# EAGLE design MultiPurpose (EAGLE 7.7.0)

## Sheet 1 of 2
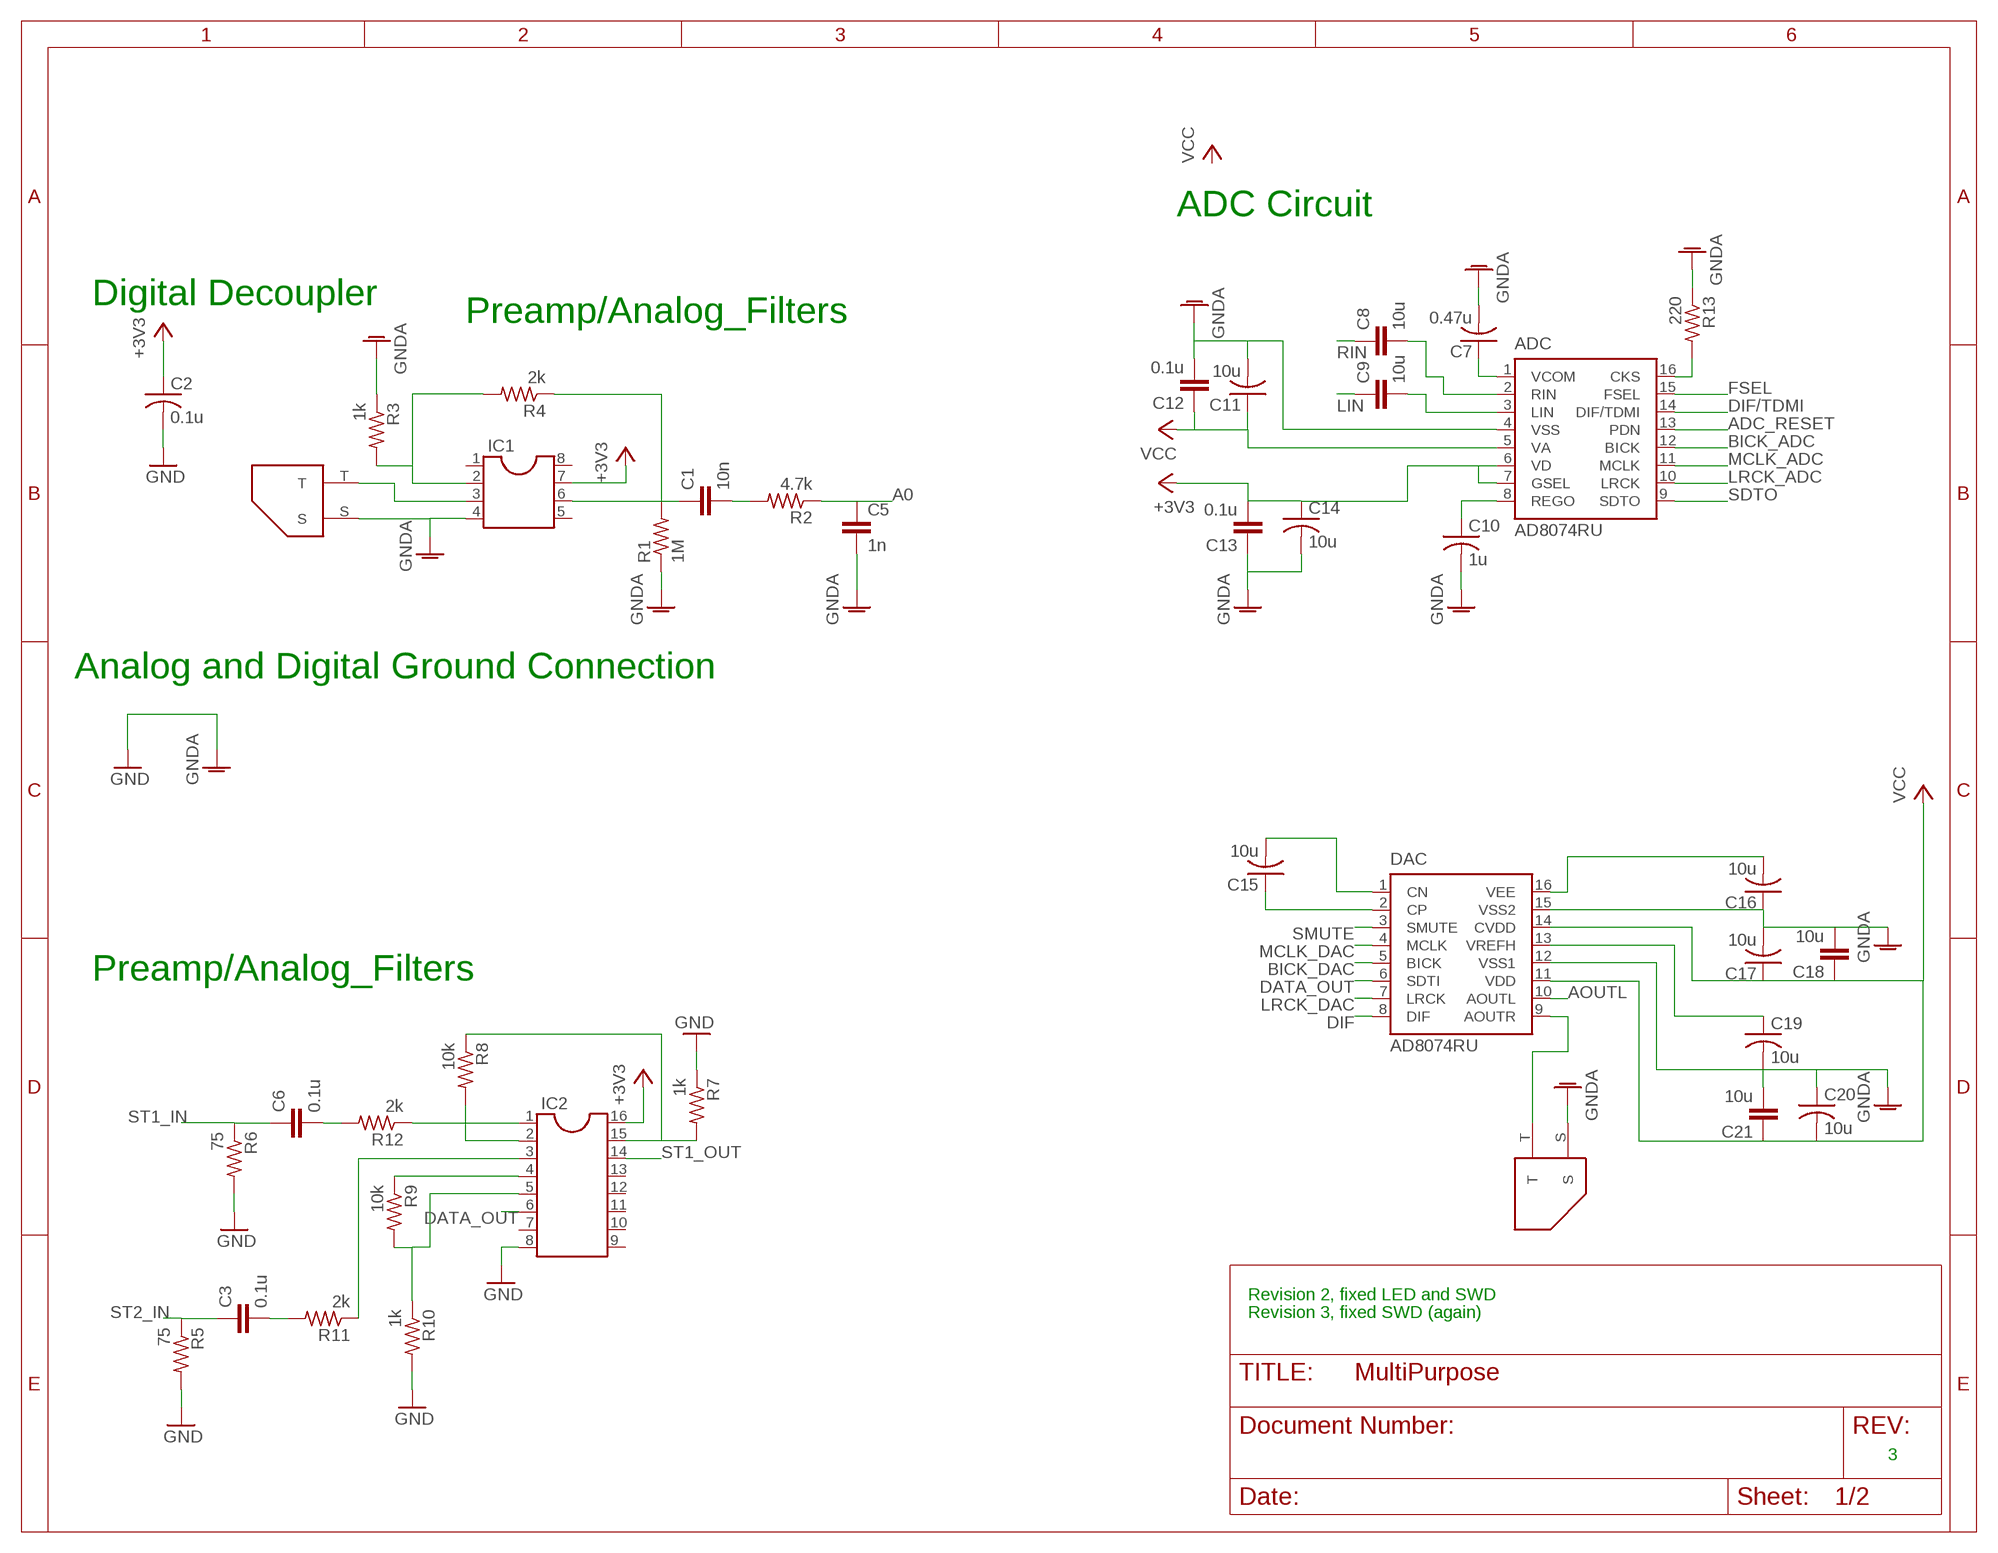
[diagram p0: schematic, sheet 1]

### Parts
ADC  AD8074RU  [TSSOP16]
C1  10n  C2.5/2  [C2.5-2]
C2  0.1u  C-US050-024X044  [C050-024X044]
C3  0.1u  C2.5/2  [C2.5-2]
C5  1n  C2.5/2  [C2.5-2]
C6  0.1u  C2.5/2  [C2.5-2]
C7  0.47u  C-US050-024X044  [C050-024X044]
C8  10u  C2.5/2  [C2.5-2]
C9  10u  C2.5/2  [C2.5-2]
C10  1u  C-US050-024X044  [C050-024X044]
C11  10u  C-US050-024X044  [C050-024X044]
C12  0.1u  C2.5/2  [C2.5-2]
C13  0.1u  C2.5/2  [C2.5-2]
C14  10u  C-US050-024X044  [C050-024X044]
C15  10u  C-US050-024X044  [C050-024X044]
C16  10u  C-US050-024X044  [C050-024X044]
C17  10u  C-US050-024X044  [C050-024X044]
C18  10u  C2.5/2  [C2.5-2]
C19  10u  C-US050-024X044  [C050-024X044]
C20  10u  C-US050-024X044  [C050-024X044]
C21  10u  C2.5/2  [C2.5-2]
DAC  AD8074RU  [TSSOP16]
IC1  DIL8S  [SOCKET-08]
IC2  DIL16S  [SOCKET-16]
R1  1M  R-US_0207/10  [0207/10]
R2  4.7k  R-US_0207/10  [0207/10]
R3  1k  R-US_0207/10  [0207/10]
R4  2k  R-US_0207/10  [0207/10]
R5  75  R-US_0207/10  [0207/10]
R6  75  R-US_0207/10  [0207/10]
R7  1k  R-US_0207/10  [0207/10]
R8  10k  R-US_0207/10  [0207/10]
R9  10k  R-US_0207/10  [0207/10]
R10  1k  R-US_0207/10  [0207/10]
R11  2k  R-US_0207/10  [0207/10]
R12  2k  R-US_0207/10  [0207/10]
R13  220  R-US_0207/10  [0207/10]
U$1  TS_JACK  [MONO_1]
U$2  TS_JACK  [MONO_1]

### Nets
+3V3: ADC.6(VD) ADC.7(GSEL) C13.2 C14.1 IC1.7 IC2.16 ; also sheet 2
+5V5: C2.1 ; supply symbol labelled +3V3
A0: C5.1 R2.1
ADC_RESET: ADC.13(PDN)
AOUTL: DAC.10(AOUTL)
AOUTR: DAC.9(AOUTR) U$2.T
BICK_ADC: ADC.12(BICK)
BICK_DAC: DAC.5(BICK)
DATA_OUT: DAC.6(SDTI) IC2.5 IC2.6 R9.2 R10.1
DIF: DAC.8(DIF)
DIF/TDMI: ADC.14(DIF/TDMI)
FSEL: ADC.15(FSEL)
GND: C2.2 IC2.8 R5.2 R6.2 R7.1 R10.2 ; supply symbol labelled GNDA ; also sheet 2
GNDA: ADC.4(VSS) C5.2 C7.2 C10.2 C11.2 C12.2 C13.1 C14.2 C16.1 C17.2 C18.2 C19.2 C20.1 C21.2 DAC.12(VSS1) DAC.15(VSS2) IC1.4 R1.1 R3.1 R13.1 U$1.S U$2.S
LIN: C9.1
LRCK_ADC: ADC.10(LRCK)
LRCK_DAC: DAC.7(LRCK)
MCLK_ADC: ADC.11(MCLK)
MCLK_DAC: DAC.4(MCLK)
N$1: ADC.1(VCOM) C7.1
N$2: IC1.3 U$1.T
N$3: IC1.2 R3.2 R4.2
N$4: C6.2 R12.2
N$5: C1.1 IC1.6 R1.2 R4.1
N$6: C1.2 R2.2
N$7: IC2.1 R12.1
N$8: IC2.2 R8.2
N$9: IC2.15 R7.2 R8.1
N$10: C3.2 R11.2
N$11: IC2.3 R11.1
N$12: IC2.4 R9.1
N$14: ADC.3(LIN) C9.2
N$15: ADC.2(RIN) C8.2
N$16: C16.2 DAC.16(VEE)
N$17: ADC.8(REGO) C10.1
N$18: ADC.16(CKS) R13.2
N$19: C15.2 DAC.1(CN)
N$20: C15.1 DAC.2(CP)
N$21: C19.1 DAC.13(VREFH)
RIN: C8.1
SDTO: ADC.9(SDTO)
SMUTE: DAC.3(SMUTE)
ST1_IN: C6.1 R6.1
ST1_OUT: IC2.14
ST2_IN: C3.1 R5.1
VCC: ADC.5(VA) C11.1 C12.1 C17.1 C18.1 C20.2 C21.1 DAC.11(VDD) DAC.14(CVDD)
Unconnected: IC1.1 IC1.5 IC1.8 IC2.7 IC2.9 IC2.10 IC2.11 IC2.12 IC2.13

### Notes on the sheet
- ADC Circuit
- Digital Decoupler
- Preamp/Analog_Filters
- Analog and Digital Ground Connection
- Preamp/Analog_Filters
- Revision 2, fixed LED and SWD
- Revision 3, fixed SWD (again)
- 3

## Sheet 2 of 2
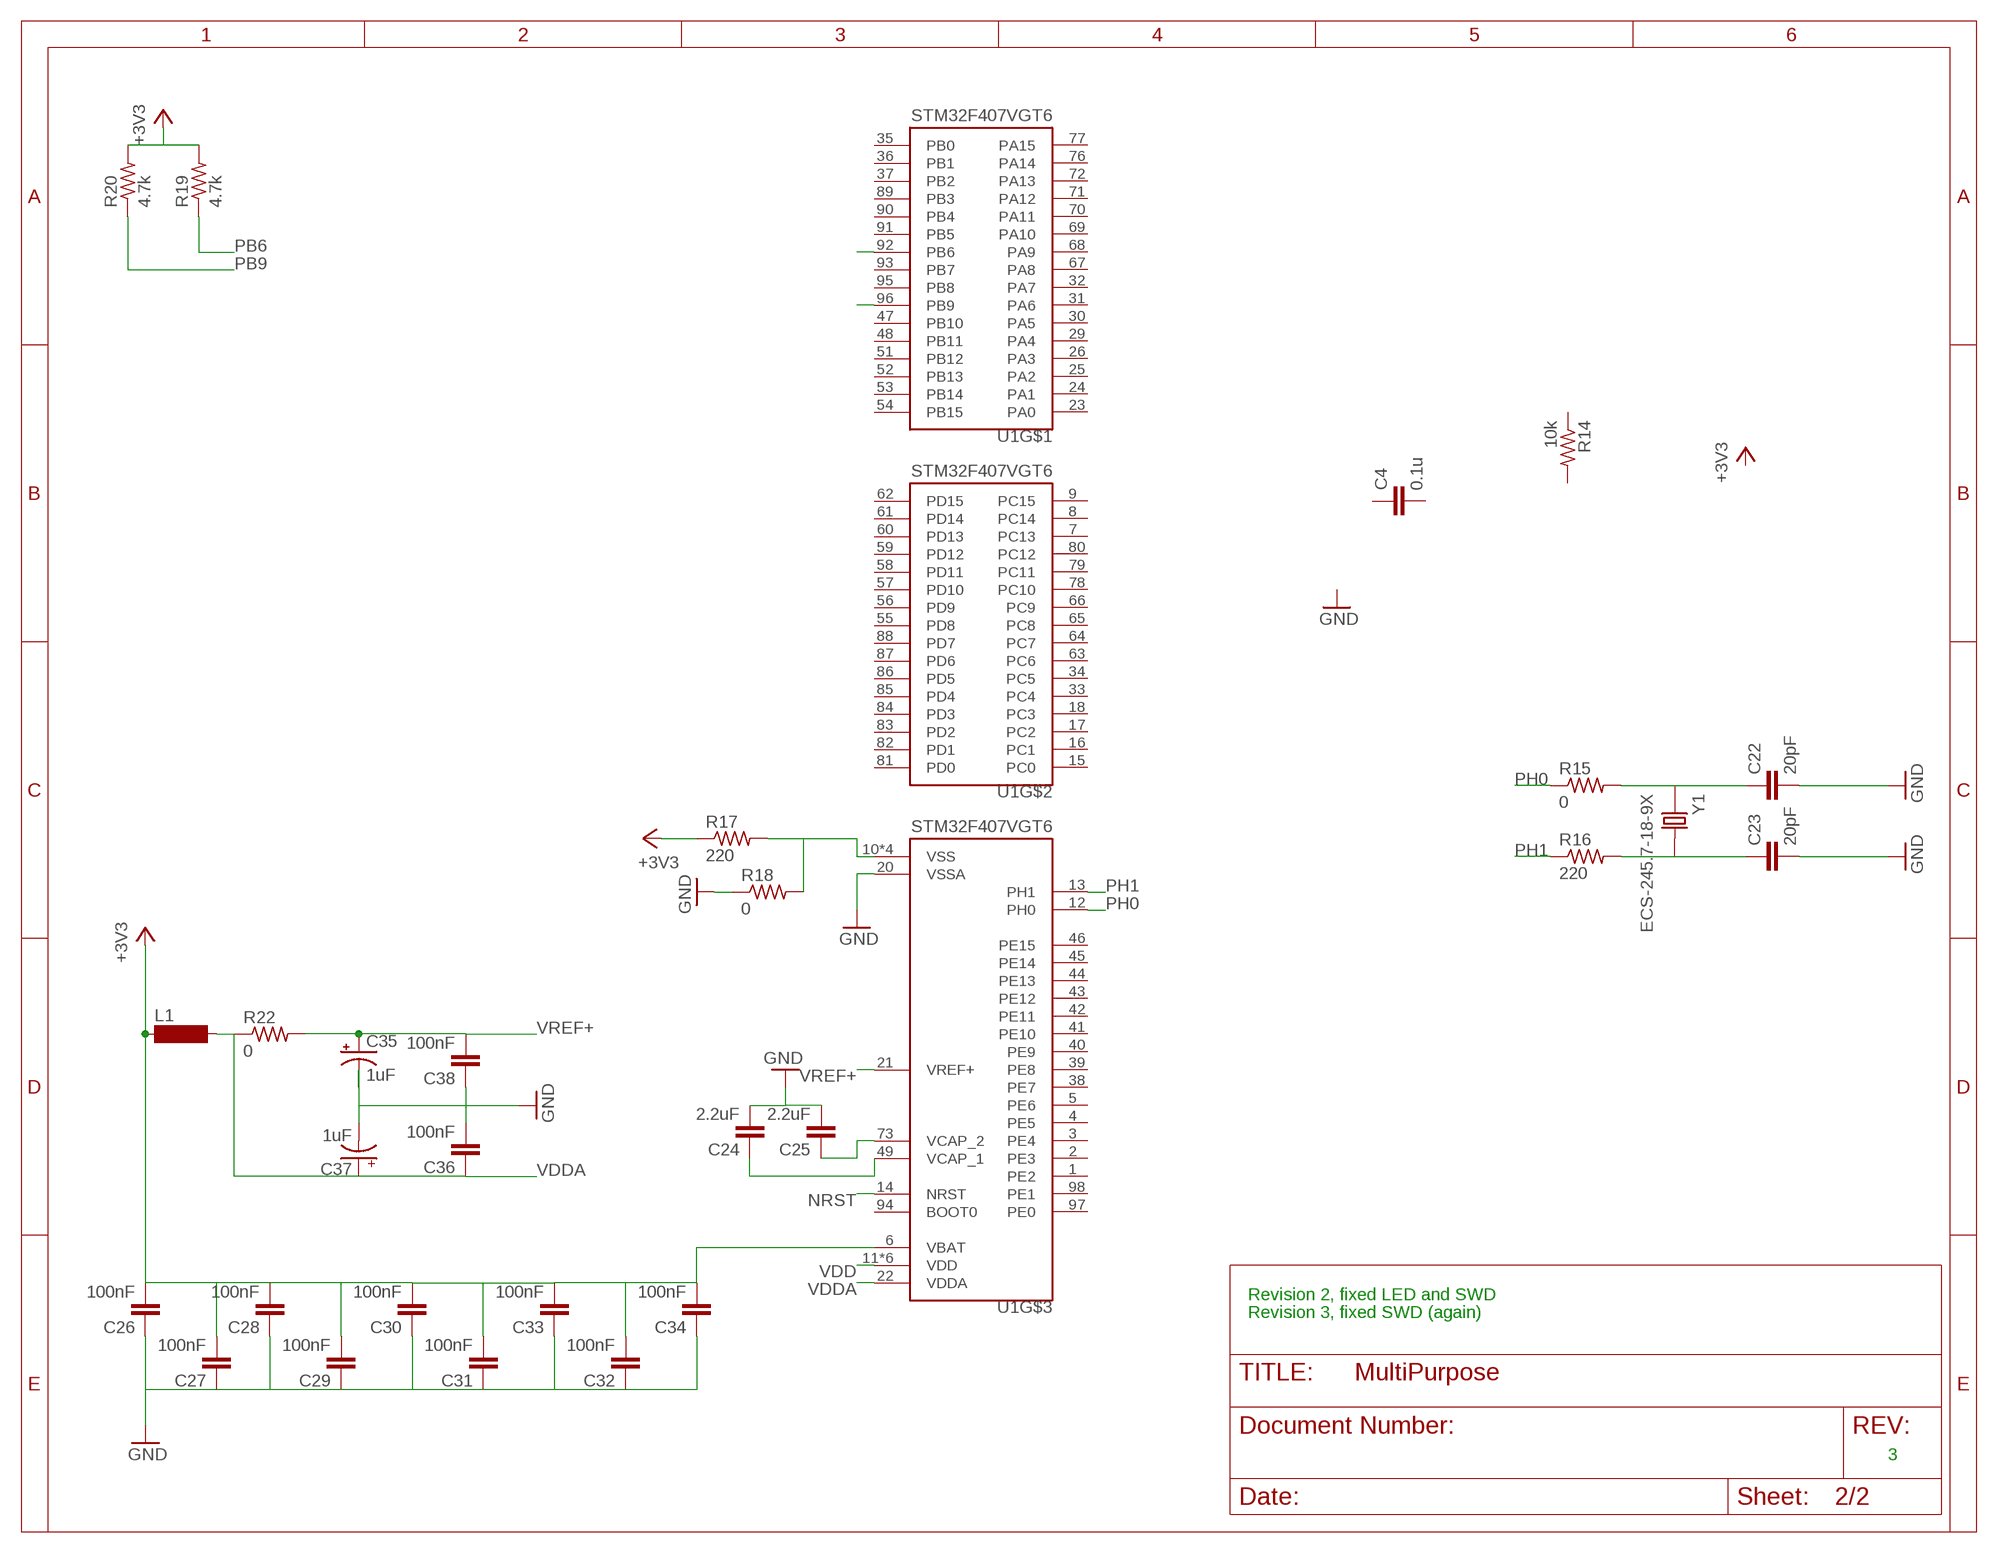
[diagram p1: schematic, sheet 2]

### Parts
C4  0.1u  C2.5/2  [C2.5-2]
C22  20pF  C2.5/2  [C2.5-2]
C23  20pF  C2.5/2  [C2.5-2]
C24  2.2uF  C2.5/2  [C2.5-2]
C25  2.2uF  C2.5/2  [C2.5-2]
C26  100nF  C2.5/2  [C2.5-2]
C27  100nF  C2.5/2  [C2.5-2]
C28  100nF  C2.5/2  [C2.5-2]
C29  100nF  C2.5/2  [C2.5-2]
C30  100nF  C2.5/2  [C2.5-2]
C31  100nF  C2.5/2  [C2.5-2]
C32  100nF  C2.5/2  [C2.5-2]
C33  100nF  C2.5/2  [C2.5-2]
C34  100nF  C2.5/2  [C2.5-2]
C35  1uF  CPOL-US139CLL-3R  [139CLL-3R]
C36  100nF  C2.5/2  [C2.5-2]
C37  1uF  CPOL-US139CLL-3R  [139CLL-3R]
C38  100nF  C2.5/2  [C2.5-2]
L1  BS75  [BS75]
R14  10k  R-US_0207/10  [0207/10]
R15  0  R-US_0207/10  [0207/10]
R16  220  R-US_0207/10  [0207/10]
R17  220  R-US_0207/10  [0207/10]
R18  0  R-US_0207/10  [0207/10]
R19  4.7k  R-US_0207/10  [0207/10]
R20  4.7k  R-US_0207/10  [0207/10]
R22  0  R-US_0207/10  [0207/10]
U1  STM32F407VGT6  [QFP50P1600X1600X160-100N]
Y1  ECS-245.7-18-9X  [XTAL_ECS-245.7-18-9X]

### Nets
+3V3: C26.2 C27.2 C28.2 C29.2 C30.2 C31.2 C32.2 C33.2 C34.2 L1.1 R17.1 R19.2 R20.2 U1.6(VBAT) ; also sheet 1
GND: C22.2 C23.2 C24.2 C25.2 C26.1 C27.1 C28.1 C29.1 C30.1 C31.1 C32.1 C33.1 C34.1 C35.- C37.- R18.1 U1.20(VSSA) ; also sheet 1
N$13: C23.1 R16.2 Y1.2
N$22: C22.1 R15.2 Y1.1
N$23: R17.2 R18.2 U1.10(VSS) U1.27(VSS) U1.74(VSS) U1.99(VSS)
N$24: C24.1 U1.49(VCAP_1)
N$25: C25.1 U1.73(VCAP_2)
N$28: C36.2 C38.1
NRST: U1.14(NRST)
PB6: R19.1 U1.92(PB6)
PB9: R20.1 U1.96(PB9)
PH0: R15.1 U1.12(PH0)
PH1: R16.1 U1.13(PH1)
VDD: U1.11(VDD) U1.19(VDD) U1.28(VDD) U1.50(VDD) U1.75(VDD) U1.100(VDD)
VDDA: C36.1 C37.+ L1.2 R22.1 U1.22(VDDA)
VREF+: C35.+ C38.2 R22.2 U1.21(VREF+)
Unconnected: C4.1 C4.2 R14.1 R14.2 U1.1(PE2) U1.2(PE3) U1.3(PE4) U1.4(PE5) U1.5(PE6) U1.7(PC13) U1.8(PC14) U1.9(PC15) U1.15(PC0) U1.16(PC1) U1.17(PC2) U1.18(PC3) U1.23(PA0) U1.24(PA1) U1.25(PA2) U1.26(PA3) U1.29(PA4) U1.30(PA5) U1.31(PA6) U1.32(PA7) U1.33(PC4) U1.34(PC5) U1.35(PB0) U1.36(PB1) U1.37(PB2) U1.38(PE7) U1.39(PE8) U1.40(PE9) U1.41(PE10) U1.42(PE11) U1.43(PE12) U1.44(PE13) U1.45(PE14) U1.46(PE15) U1.47(PB10) U1.48(PB11) U1.51(PB12) U1.52(PB13) U1.53(PB14) U1.54(PB15) U1.55(PD8) U1.56(PD9) U1.57(PD10) U1.58(PD11) U1.59(PD12) U1.60(PD13) U1.61(PD14) U1.62(PD15) U1.63(PC6) U1.64(PC7) U1.65(PC8) U1.66(PC9) U1.67(PA8) U1.68(PA9) U1.69(PA10) U1.70(PA11) U1.71(PA12) U1.72(PA13) U1.76(PA14) U1.77(PA15) U1.78(PC10) U1.79(PC11) U1.80(PC12) U1.81(PD0) U1.82(PD1) U1.83(PD2) U1.84(PD3) U1.85(PD4) U1.86(PD5) U1.87(PD6) U1.88(PD7) U1.89(PB3) U1.90(PB4) U1.91(PB5) U1.93(PB7) U1.94(BOOT0) U1.95(PB8) U1.97(PE0) U1.98(PE1)

### Notes on the sheet
- Revision 2, fixed LED and SWD
- Revision 3, fixed SWD (again)
- 3

## Library data of the parts
ADC = analog-devices:AD807*: 500 MHz, G = +1 and +2 Triple Video Buffers with Disable Source: http://www.analog.com/static/imported-files/data_sheets/AD8074_8075.pdf; MPN: AD8074ARUZ; OC_FARNELL: 9426027; OC_NEWARK: 19M0929
C1 C3-C6 C8 C9 C12 C13 C18 C21-C34 C36 C38 = capacitor-wima:C: CAPACITOR naming: grid - package width
C2 C7 C10 C11 C14-C17 C19 C20 = rcl:C-US: CAPACITOR, American symbol
C35 C37 = rcl:CPOL-US: POLARIZED CAPACITOR, American symbol
DAC = analog-devices-3:AD807*: 500 MHz, G = +1 and +2 Triple Video Buffers with Disable Source: http://www.analog.com/static/imported-files/data_sheets/AD8074_8075.pdf
IC1 = ic-package:DIL8: Dual In Line / Socket
IC2 = ic-package:DIL16: Dual In Line / Socket
L1 = inductor-neosid:BS: INDUCTOR nominal inductance, magnetically screened; OC_FARNELL: unknown; OC_NEWARK: unknown
R1-R20 R22 = rcl:R-US_: RESISTOR, American symbol
U1 = STM32F407VGT6:STM32F407VGT6: STM32 Series 32-bit 1 MB Flash 192 kB RAM ARM Based Microcontroller - LQFP-100; DESCRIPTION: STM32 Series 32-bit 1 MB Flash 192 kB RAM ARM Based Microcontroller - LQFP-100; DIGI-KEY_PART_NUMBER: 497-11605-ND; DIGI-KEY_PURCHASE_URL: https://www.digikey.com/product-detail/en/stmicroelectronics/STM32F407VGT6/497-11605-ND/2747117?utm_source=snapeda&utm_medium=aggregator&utm_campaign=symbol; MF: STMicroelectronics; MP: STM32F407VGT6; PACKAGE: LQFP-100 STMicroelectronics
U$1 U$2 = MultiPurpose:TS_JACK: TS MONO Guitar Jack
Y1 = ECS-245.7-18-9X:ECS-245.7-18-9X: Crystal Cylindrical Can, Radial; DESCRIPTION: Crystal 24.576MHz 18pF 2-Pin Radial; DIGI-KEY_PART_NUMBER: XC1387-ND; DIGI-KEY_PURCHASE_URL: https://www.digikey.com/product-detail/en/ecs-inc/ECS-245.7-18-9X/XC1387-ND/827649?utm_source=snapeda&utm_medium=aggregator&utm_campaign=symbol; MF: ECS Inc.; MP: ECS-245.7-18-9X; PACKAGE: Cylindrical Can Radial ECS International

## Board
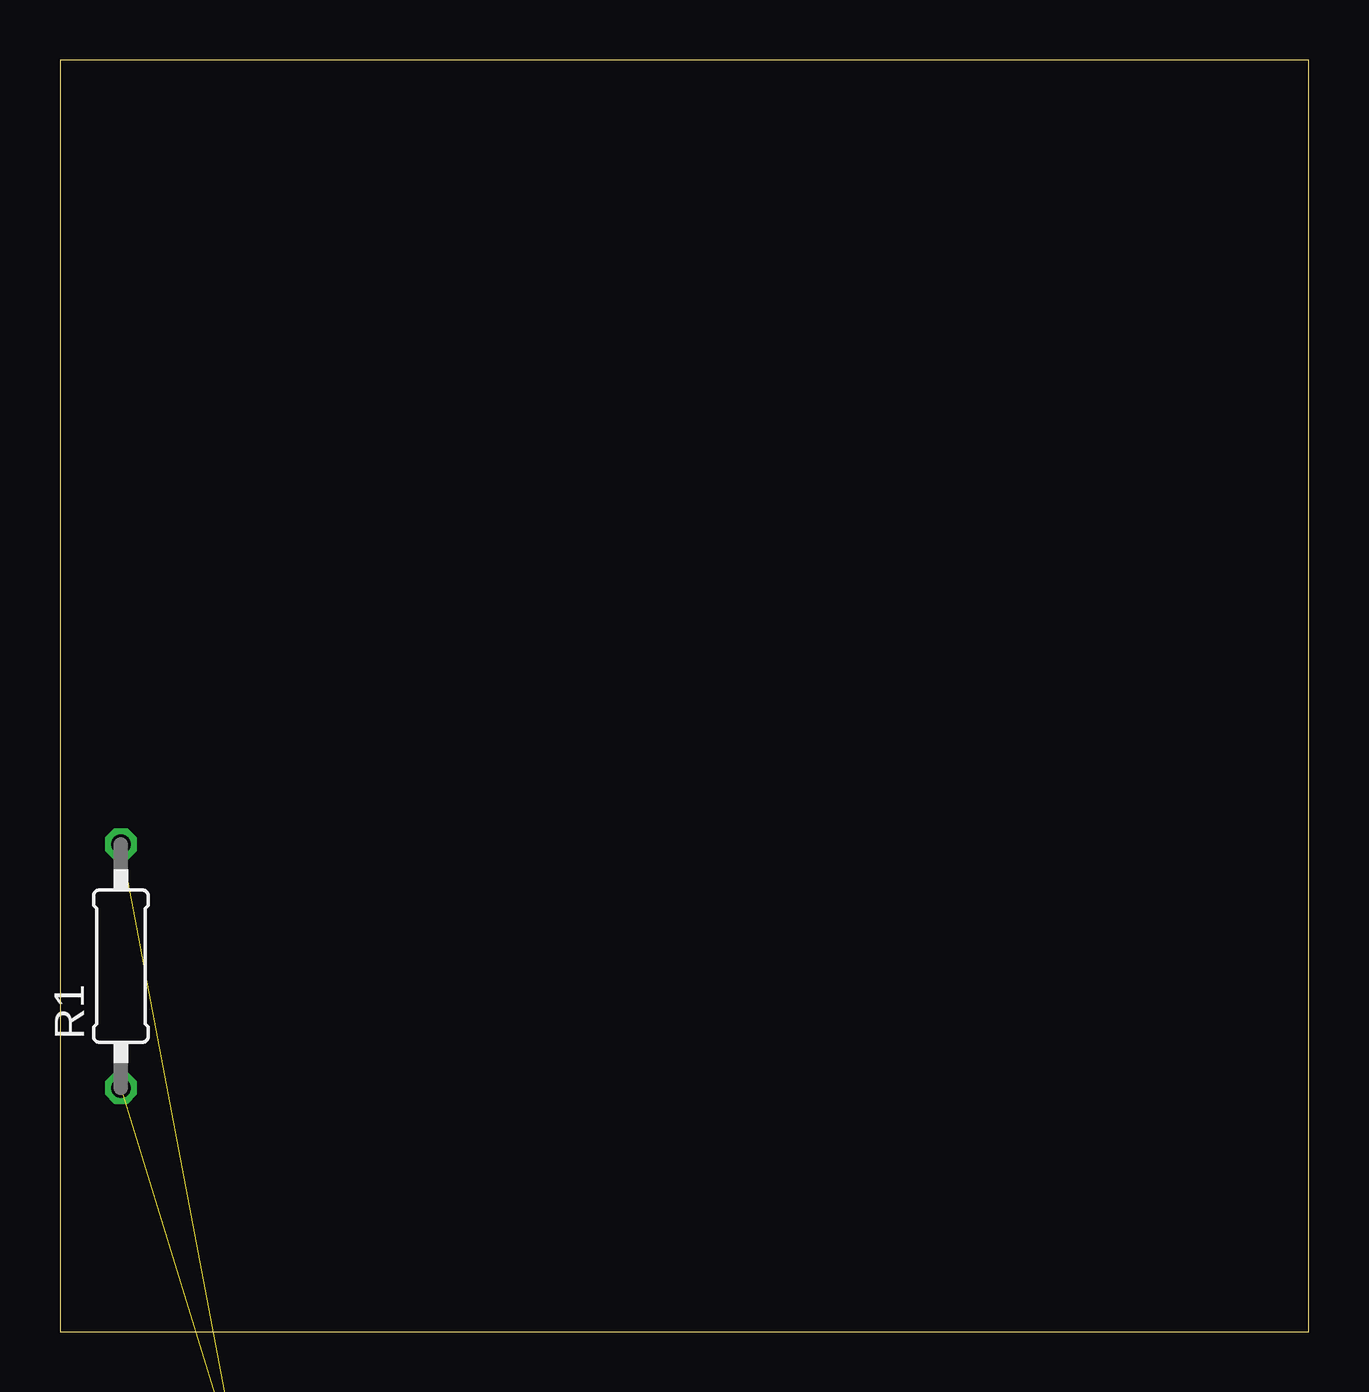
[diagram p2: board, top side]
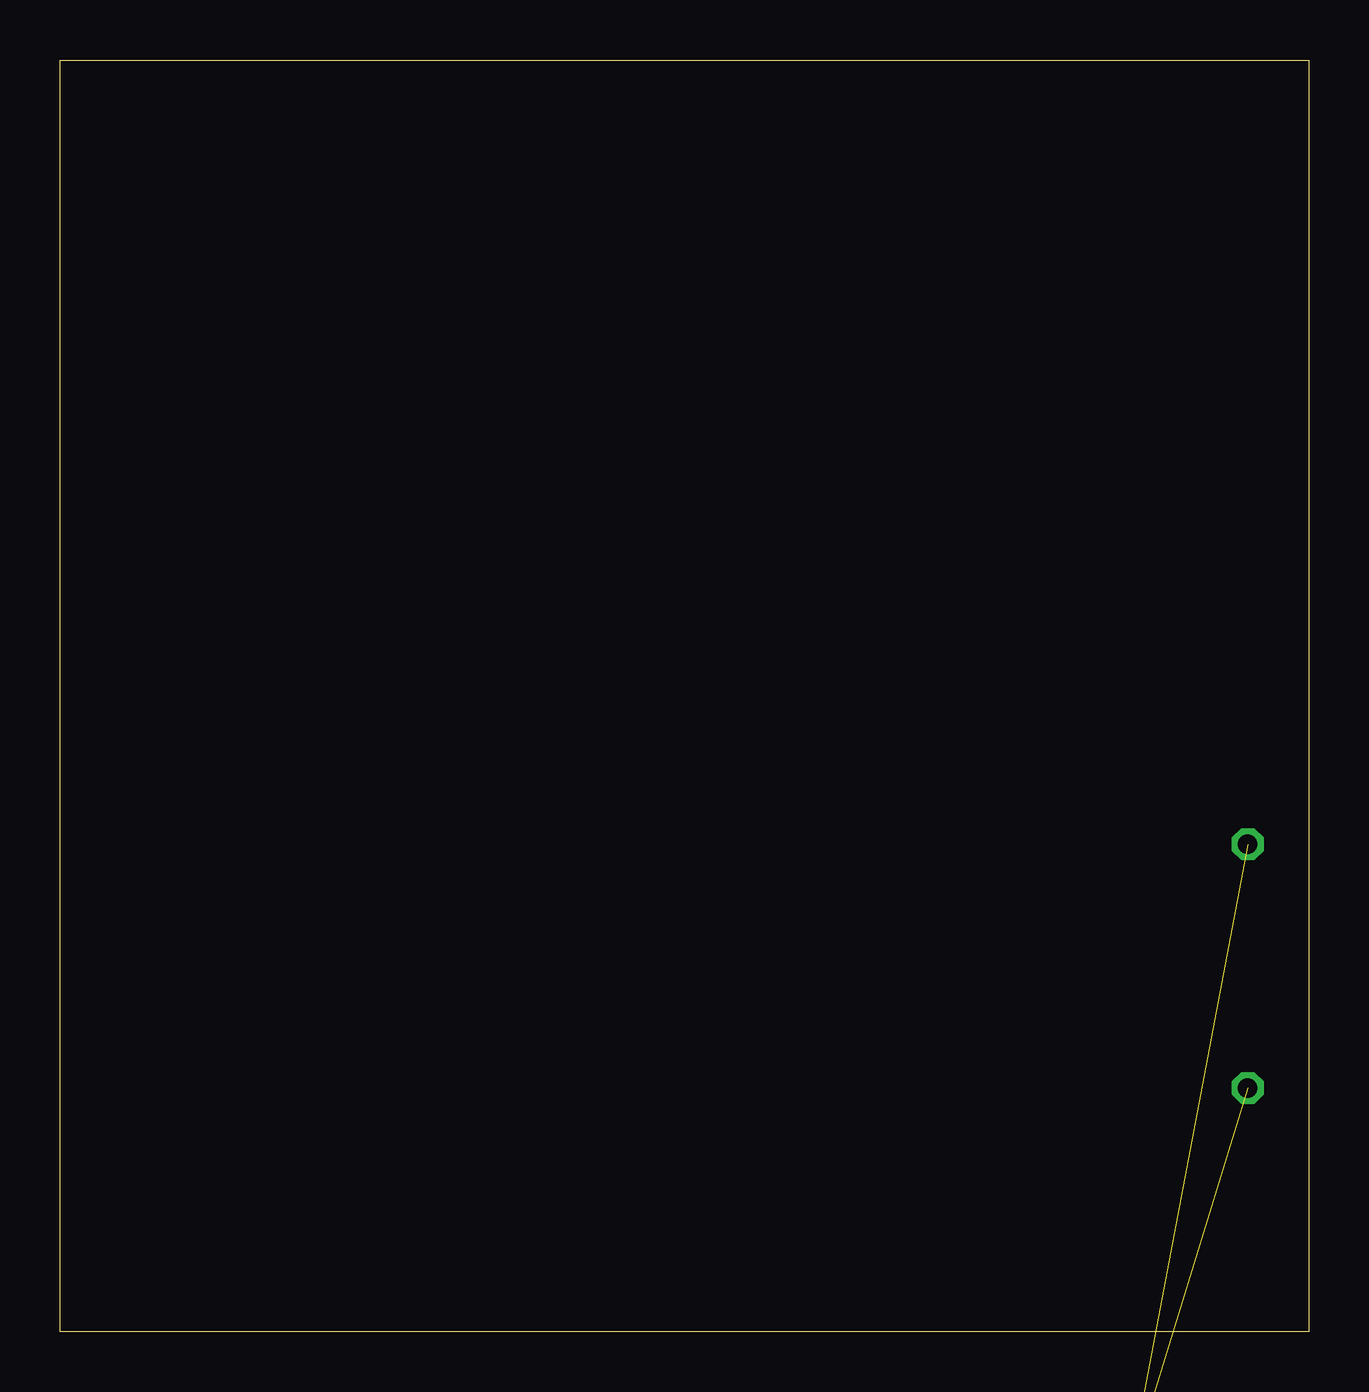
[diagram p3: board, bottom side, seen from below]

Size 52.05 x 53.01 mm. Coordinates in mm from the lower left corner, seen from the top.
Outline: 0,0 52.05,0 52.05,53.01 0,53.01 0,0
Copper layers (1*16): Top 0.035mm / dielectric 1.5mm / Bottom 0.035mm
Design rules "MWSEagleDesignRules3": minimum track width 13mil, minimum drill 22mil, track to track 8.5mil, track to pad 8.5mil, pad to pad 8.5mil, via to via 8.5mil, smd to smd 8mil, copper to edge 40mil, drill to drill 8mil, minimum pad ring 10mil, minimum via ring 8mil, stop-mask expansion 4mil, vias tented up to drill 0mil, thermal gap 10mil

### Footprints (pad centres in the part's own frame; a part is rotated, then mirrored left to right if it is on the bottom)
TSSOP16 = smd 0.9 x 0.35: 1 -2.875,2.275; 2 -2.875,1.625; 3 -2.875,0.975; 4 -2.875,0.325; 5 -2.875,-0.325; 6 -2.875,-0.975; 7 -2.875,-1.625; 8 -2.875,-2.275; 9 2.875,-2.275; 10 2.875,-1.625; 11 2.875,-0.975; 12 2.875,-0.325; 13 2.875,0.325; 14 2.875,0.975; 15 2.875,1.625; 16 2.875,2.275
C2.5-2 = drill 0.813 pad 1.6 octagon: 1 -1.27,0; 2 1.27,0
C050-024X044 = drill 0.813 octagon: 1 -2.54,0; 2 2.54,0
139CLL-3R = smd 3.5 x 2.8: + 6.2,0; - -6.2,0
SOCKET-08 = drill 0.813 long: 1 -3.81,-3.81; 2 -1.27,-3.81; 3 1.27,-3.81; 4 3.81,-3.81; 5 3.81,3.81; 6 1.27,3.81; 7 -1.27,3.81; 8 -3.81,3.81
SOCKET-16 = drill 0.813 long: 1 -8.89,-3.81; 2 -6.35,-3.81; 3 -3.81,-3.81; 4 -1.27,-3.81; 5 1.27,-3.81; 6 3.81,-3.81; 7 6.35,-3.81; 8 8.89,-3.81; 9 8.89,3.81; 10 6.35,3.81; 11 3.81,3.81; 12 1.27,3.81; 13 -1.27,3.81; 14 -3.81,3.81; 15 -6.35,3.81; 16 -8.89,3.81
BS75 = drill 0.6 long: 1 -2.5,0; 2 2.5,0
0207/10 = drill 0.813 octagon: 1 -5.08,0; 2 5.08,0
QFP50P1600X1600X160-100N = smd 1.56 x 0.28: 1 -7.68,6; 2 -7.68,5.5; 3 -7.68,5; 4 -7.68,4.5; 5 -7.68,4; 6 -7.68,3.5; 7 -7.68,3; 8 -7.68,2.5; 9 -7.68,2; 10 -7.68,1.5; 11 -7.68,1; 12 -7.68,0.5; 13 -7.68,0; 14 -7.68,-0.5; 15 -7.68,-1; 16 -7.68,-1.5; 17 -7.68,-2; 18 -7.68,-2.5; 19 -7.68,-3; 20 -7.68,-3.5; 21 -7.68,-4; 22 -7.68,-4.5; 23 -7.68,-5; 24 -7.68,-5.5; 25 -7.68,-6; 51 7.68,-6; 52 7.68,-5.5; 53 7.68,-5; 54 7.68,-4.5; 55 7.68,-4; 56 7.68,-3.5; 57 7.68,-3; 58 7.68,-2.5; 59 7.68,-2; 60 7.68,-1.5; 61 7.68,-1; 62 7.68,-0.5; 63 7.68,0; 64 7.68,0.5; 65 7.68,1; 66 7.68,1.5; 67 7.68,2; 68 7.68,2.5; 69 7.68,3; 70 7.68,3.5; 71 7.68,4; 72 7.68,4.5; 73 7.68,5; 74 7.68,5.5; 75 7.68,6 | smd 0.28 x 1.56: 26 -6,-7.68; 27 -5.5,-7.68; 28 -5,-7.68; 29 -4.5,-7.68; 30 -4,-7.68; 31 -3.5,-7.68; 32 -3,-7.68; 33 -2.5,-7.68; 34 -2,-7.68; 35 -1.5,-7.68; 36 -1,-7.68; 37 -0.5,-7.68; 38 0,-7.68; 39 0.5,-7.68; 40 1,-7.68; 41 1.5,-7.68; 42 2,-7.68; 43 2.5,-7.68; 44 3,-7.68; 45 3.5,-7.68; 46 4,-7.68; 47 4.5,-7.68; 48 5,-7.68; 49 5.5,-7.68; 50 6,-7.68; 76 6,7.68; 77 5.5,7.68; 78 5,7.68; 79 4.5,7.68; 80 4,7.68; 81 3.5,7.68; 82 3,7.68; 83 2.5,7.68; 84 2,7.68; 85 1.5,7.68; 86 1,7.68; 87 0.5,7.68; 88 0,7.68; 89 -0.5,7.68; 90 -1,7.68; 91 -1.5,7.68; 92 -2,7.68; 93 -2.5,7.68; 94 -3,7.68; 95 -3.5,7.68; 96 -4,7.68; 97 -4.5,7.68; 98 -5,7.68; 99 -5.5,7.68; 100 -6,7.68
MONO_1 = drill 0.8 square: S 1.27,0; T -1.27,0
XTAL_ECS-245.7-18-9X = drill 0.52 pad 0.92: 1 -0.55,0; 2 0.55,0

### Placement (x,y rotation side)
ADC  -8.64,-145.29 0 top  (outside the outline)
C1  -3.56,-179.83 0 top  (outside the outline)
C2  5.08,-130.56 0 top  (outside the outline)
C3  -3.56,-309.88 0 top  (outside the outline)
C4  0,-376.43 0 top  (outside the outline)
C5  5.59,-30.48 0 top  (outside the outline)
C6  -3.56,-227.58 0 top  (outside the outline)
C7  -31.5,-438.91 0 top  (outside the outline)
C8  -30.99,-453.64 0 top  (outside the outline)
C9  -30.99,-469.9 0 top  (outside the outline)
C10  -31.5,-484.63 0 top  (outside the outline)
C11  -31.5,-497.84 0 top  (outside the outline)
C12  -30.99,-512.57 0 top  (outside the outline)
C13  -30.99,-528.83 0 top  (outside the outline)
C14  -31.5,-543.56 0 top  (outside the outline)
C15  -31.5,-569.98 0 top  (outside the outline)
C16  -31.5,-583.18 0 top  (outside the outline)
C17  -31.5,-596.39 0 top  (outside the outline)
C18  -30.99,-611.12 0 top  (outside the outline)
C19  -31.5,-625.86 0 top  (outside the outline)
C20  -31.5,-639.06 0 top  (outside the outline)
C21  -30.99,-653.8 0 top  (outside the outline)
C22  -30.99,-709.68 0 top  (outside the outline)
C23  -30.99,-725.93 0 top  (outside the outline)
C24  -30.99,-768.6 0 top  (outside the outline)
C25  -30.99,-784.86 0 top  (outside the outline)
C26  -30.99,-827.53 0 top  (outside the outline)
C27  -30.99,-843.79 0 top  (outside the outline)
C28  -30.99,-860.04 0 top  (outside the outline)
C29  -30.99,-876.3 0 top  (outside the outline)
C30  -30.99,-892.56 0 top  (outside the outline)
C31  -30.99,-908.81 0 top  (outside the outline)
C32  -30.99,-925.07 0 top  (outside the outline)
C33  -30.99,-941.32 0 top  (outside the outline)
C34  -30.99,-957.58 0 top  (outside the outline)
C35  -28.45,-1073.4 0 top  (outside the outline)
C36  -30.99,-1003.3 0 top  (outside the outline)
C37  -28.45,-1083.06 0 top  (outside the outline)
C38  -30.99,-1035.81 0 top  (outside the outline)
DAC  -17.78,-352.55 0 top  (outside the outline)
IC1  6.6,-11.68 0 top  (outside the outline)
IC2  2.54,-161.04 0 top  (outside the outline)
L1  -32.51,-1062.74 0 top  (outside the outline)
R1  2.54,15.24 90 top
R2  7.62,-90.93 0 top  (outside the outline)
R3  7.62,-104.14 0 top  (outside the outline)
R4  7.62,-143.76 0 top  (outside the outline)
R5  -1.02,-295.15 0 top  (outside the outline)
R6  -1.02,-212.85 0 top  (outside the outline)
R7  -1.02,-281.94 0 top  (outside the outline)
R8  -1.02,-268.73 0 top  (outside the outline)
R9  -1.02,-337.82 0 top  (outside the outline)
R10  -1.02,-351.03 0 top  (outside the outline)
R11  -1.02,-324.61 0 top  (outside the outline)
R12  -1.02,-242.32 0 top  (outside the outline)
R13  -28.96,-556.77 0 top  (outside the outline)
R14  -28.96,-425.7 0 top  (outside the outline)
R15  -28.96,-681.74 0 top  (outside the outline)
R16  -28.96,-694.94 0 top  (outside the outline)
R17  -28.96,-740.66 0 top  (outside the outline)
R18  -28.96,-753.87 0 top  (outside the outline)
R19  -28.96,-799.59 0 top  (outside the outline)
R20  -28.96,-812.8 0 top  (outside the outline)
R22  -28.96,-1050.54 0 top  (outside the outline)
U1  -31.5,-357.12 0 top  (outside the outline)
U$1  4.06,-117.35 0 top  (outside the outline)
U$2  -32.51,-668.53 0 top  (outside the outline)
Y1  -16.26,-363.22 0 top  (outside the outline)

### Tracks (layer width: path | path; a pad name or v marks a point on that pad's centre or on a via)
+3V3  (19 unrouted)
A0  (1 unrouted)
AOUTR  (1 unrouted)
DATA_OUT  (4 unrouted)
GND  (22 unrouted)
  cutout Bottom (isolate 1.27): 0,52.83 51.82,52.83 51.82,0 0,0
GNDA  (21 unrouted)
N$1  (1 unrouted)
N$2  (1 unrouted)
N$3  (2 unrouted)
N$4  (1 unrouted)
N$5  (3 unrouted)
N$6  (1 unrouted)
N$7  (1 unrouted)
N$8  (1 unrouted)
N$9  (2 unrouted)
N$10  (1 unrouted)
N$11  (1 unrouted)
N$12  (1 unrouted)
N$13  (2 unrouted)
N$14  (1 unrouted)
N$15  (1 unrouted)
N$16  (1 unrouted)
N$17  (1 unrouted)
N$18  (1 unrouted)
N$19  (1 unrouted)
N$20  (1 unrouted)
N$21  (1 unrouted)
N$22  (2 unrouted)
N$23  (5 unrouted)
N$24  (1 unrouted)
N$25  (1 unrouted)
N$28  (1 unrouted)
PB6  (1 unrouted)
PB9  (1 unrouted)
PH0  (1 unrouted)
PH1  (1 unrouted)
ST1_IN  (1 unrouted)
ST2_IN  (1 unrouted)
VCC  (8 unrouted)
VDD  (5 unrouted)
VDDA  (4 unrouted)
VREF+  (3 unrouted)